# Altium schematic sheet AudioReactiveCircuit_schematic_V1.SchDoc
size A; SheetNumber: 1; SheetTotal: 1
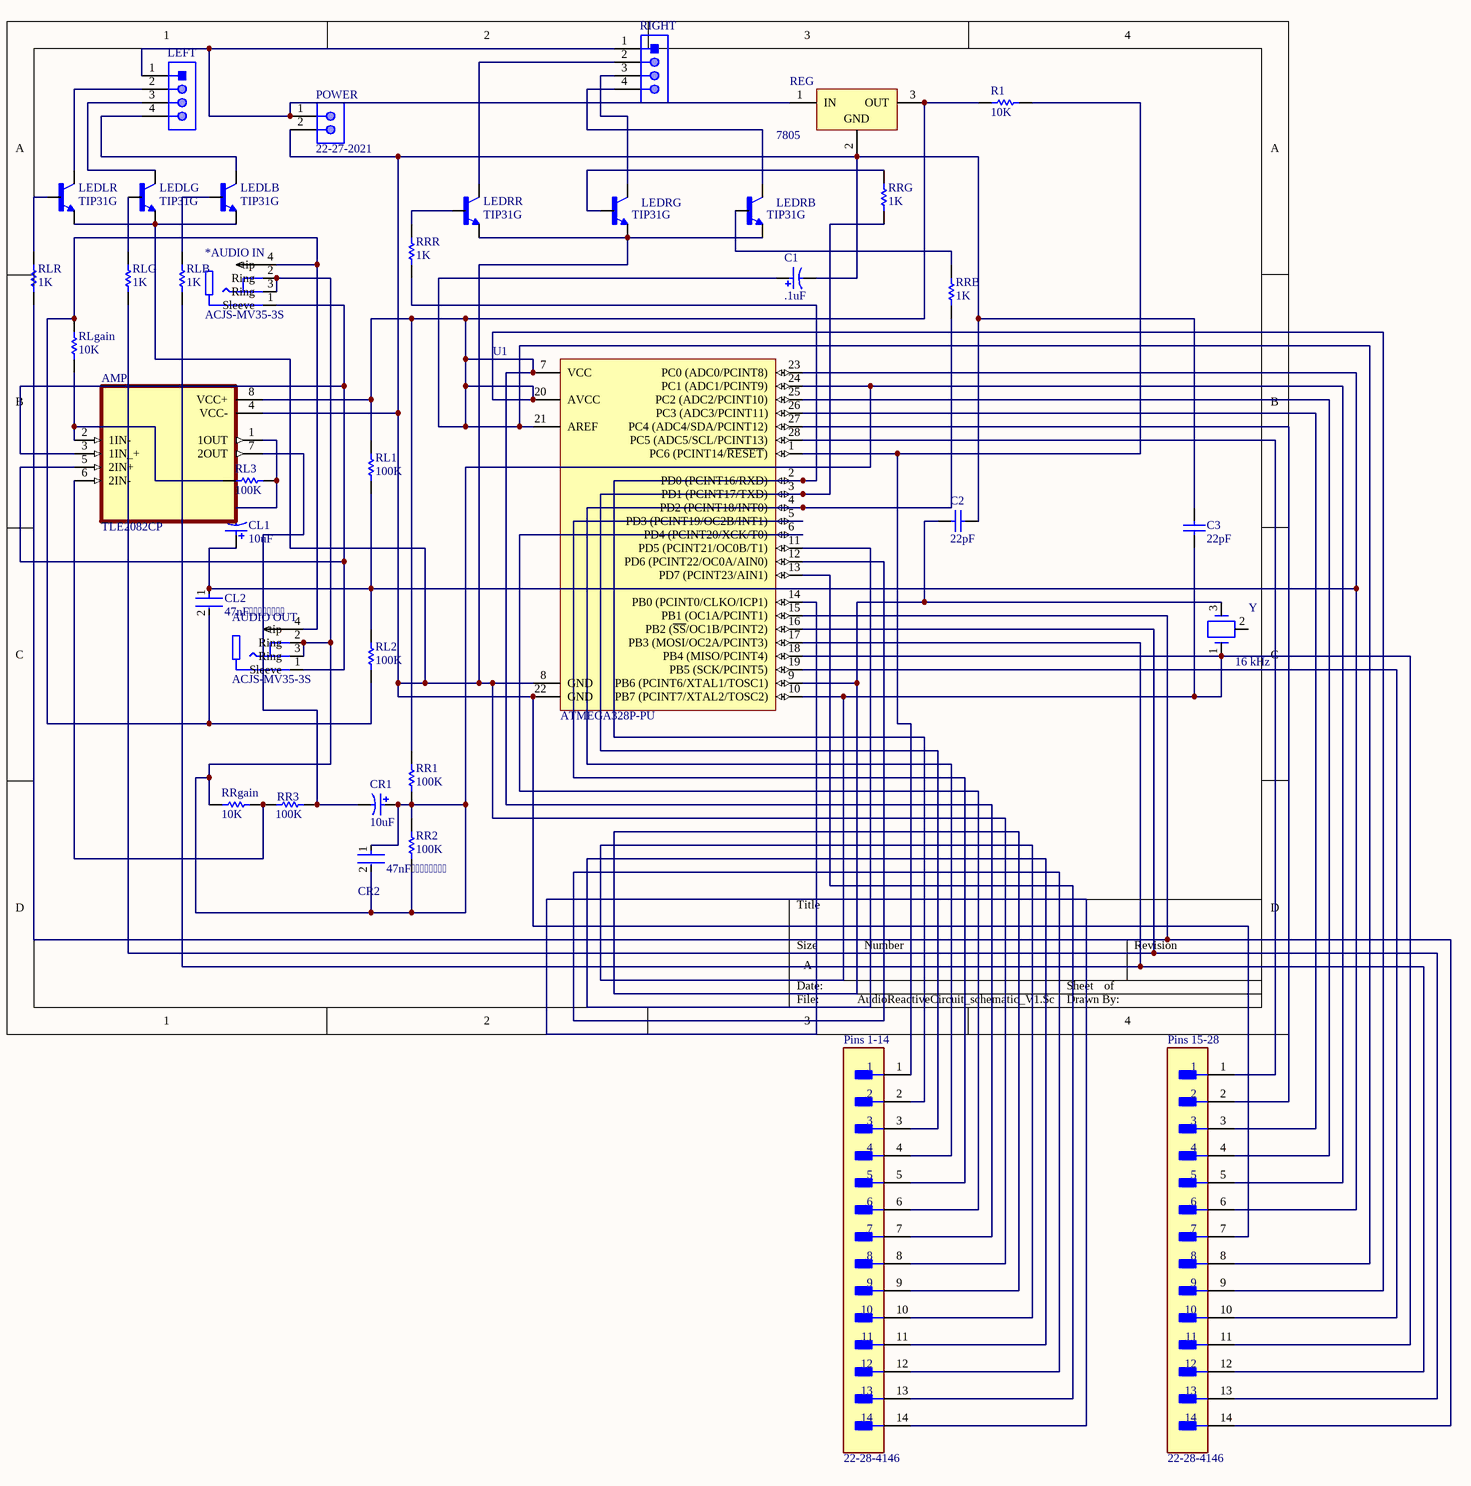
[diagram p0: AudioReactiveCircuit_schematic_V1.SchDoc]

## Parts
*AUDIO_IN  ACJS-MV35-3S  [AMPHENOL_ACJM-MV35-2S]
AMP  TLE2082CP  [DIP794W45P254L959H508Q8]
AUDIO_OUT  ACJS-MV35-3S  [AMPHENOL_ACJM-MV35-2S]
C1  .1uF  [CAPPR55-200-1100X500X1200]
C2  22pF  [KEMT-C315-THT-2]
C3  22pF  [KEMT-C315-THT-2]
CL1  10uF  [CAPPR55-200-1100X500X1200]
CL2  47nF  [FP-RDE2M1-MFG]
CR1  10uF  [CAPPR55-200-1100X500X1200]
CR2  47nF  [FP-RDE2M1-MFG]
LEDLB  TIP31G  [TO254P1060X482X2222-3]
LEDLG  TIP31G  [TO254P1060X482X2222-3]
LEDLR  TIP31G  [TO254P1060X482X2222-3]
LEDRB  TIP31G  [TO254P1060X482X2222-3]
LEDRG  TIP31G  [TO254P1060X482X2222-3]
LEDRR  TIP31G  [TO254P1060X482X2222-3]
LEFT  61300411121  [61300411121]  (value not drawn)
Pins_1-14  22-28-4146  [FP-22-28-4146-MFG]
Pins_15-28  22-28-4146  [FP-22-28-4146-MFG]
POWER  22-27-2021  [MOLX-22-27-2021_V]
R1  10K  [RESA60-630X240]
REG  7805  [TO220]
RIGHT  6  [61300411121]  (value not drawn)
RL1  100K  [RESA60-630X240]
RL2  100K  [RESA60-630X240]
RL3  100K  [RESA60-630X240]
RLB  1K  [RESA60-630X240]
RLG  1K  [RESA60-630X240]
RLgain  10K  [RESA60-630X240]
RLR  1K  [RESA60-630X240]
RR1  100K  [RESA60-630X240]
RR2  100K  [RESA60-630X240]
RR3  100K  [RESA60-630X240]
RRB  1K  [RESA60-630X240]
RRG  1K  [RESA60-630X240]
RRgain  10K  [RESA60-630X240]
RRR  1K  [RESA60-630X240]
U1  ATMEGA328P-PU  [ATML-28P3]
Y  16 kHz  [ECS-4X-3IL]

## Nets
Net*AUDIO_IN_1: *AUDIO_IN.1(Sleeve) AMP.3(1IN_+) AMP.5(2IN+) AUDIO_OUT.1(Sleeve)
Net*AUDIO_IN_2: *AUDIO_IN.2(Ring) *AUDIO_IN.3(Ring) AUDIO_OUT.2(Ring) AUDIO_OUT.3(Ring) CR1.1 CR2.1 CR2.2 Pins_15-28.5 RR1.1 RR2.1 RR2.2 RRgain.2 U1.24(PC1_(ADC1/PCINT9))
Net*AUDIO_IN_4: *AUDIO_IN.4(tip) AUDIO_OUT.4(tip) CL2.2 RL2.1 RLgain.2
NetAMP_1: AMP.1(1OUT) CL1.2 RL3.1
NetAMP_2: AMP.2(1IN-) RL3.2 RLgain.1
NetAMP_4: AMP.4(VCC-) C1.2 C2.1 C3.2 LEDLB.3(E) LEDLG.3(E) LEDLR.3(E) LEDRB.3(E) LEDRG.3(E) LEDRR.3(E) Pins_1-14.8 Pins_15-28.7 POWER.2 REG.2(GND) U1.8(GND) U1.22(GND)
NetAMP_6: AMP.6(2IN-) RR3.2 RRgain.1
NetAMP_7: AMP.7(2OUT) CR1.2 RR3.1
NetAMP_8: AMP.8(VCC+) C1.1 Pins_1-14.7 Pins_15-28.8 Pins_15-28.9 R1.1 REG.3(OUT) RL1.2 RR1.2 U1.7(VCC) U1.20(AVCC) U1.21(AREF)
NetC2_2: C2.2 Pins_1-14.9 U1.9(PB6_(PCINT6/XTAL1/TOSC1)) Y.3
NetC3_1: C3.1 Pins_1-14.10 Pins_15-28.11 U1.10(PB7_(PCINT7/XTAL2/TOSC2)) U1.18(PB4_(MISO/PCINT4)) Y.1
NetCL1_1: CL1.1 CL2.1 Pins_15-28.6 RL1.1 RL2.2 U1.23(PC0_(ADC0/PCINT8))
NetLEDLB_1: LEDLB.1(B) RLB.2
NetLEDLB_2: LEDLB.2(C) LEFT.4
NetLEDLG_1: LEDLG.1(B) RLG.1
NetLEDLG_2: LEDLG.2(C) LEFT.3
NetLEDLR_1: LEDLR.1(B) RLR.1
NetLEDLR_2: LEDLR.2(C) LEFT.2
NetLEDRB_1: LEDRB.1(B) RRB.2
NetLEDRB_2: LEDRB.2(C) RIGHT.4
NetLEDRG_1: LEDRG.1(B) RRG.2
NetLEDRG_2: LEDRG.2(C) RIGHT.3
NetLEDRR_1: LEDRR.1(B) RRR.2
NetLEDRR_2: LEDRR.2(C) RIGHT.2
NetLEFT_1: LEFT.1 POWER.1 REG.1(IN) RIGHT.1
NetPins_1-14_1: Pins_1-14.1 R1.2 U1.1(PC6_(PCINT14/~{RESET}))
NetPins_1-14_2: Pins_1-14.2 RRR.1 U1.2(PD0_(PCINT16/RXD))
NetPins_1-14_3: Pins_1-14.3 RRG.1 U1.3(PD1_(PCINT17/TXD))
NetPins_1-14_4: Pins_1-14.4 RRB.1 U1.4(PD2_(PCINT18/INT0))
NetPins_1-14_5: Pins_1-14.5 U1.5(PD3_(PCINT19/OC2B/INT1))
NetPins_1-14_6: Pins_1-14.6 U1.6(PD4_(PCINT20/XCK/T0))
NetPins_1-14_11: Pins_1-14.11 U1.11(PD5_(PCINT21/OC0B/T1))
NetPins_1-14_12: Pins_1-14.12 U1.12(PD6_(PCINT22/OC0A/AIN0))
NetPins_1-14_13: Pins_1-14.13 U1.13(PD7_(PCINT23/AIN1))
NetPins_1-14_14: Pins_1-14.14 U1.14(PB0_(PCINT0/CLKO/ICP1))
NetPins_15-28_1: Pins_15-28.1 U1.28(PC5_(ADC5/SCL/PCINT13))
NetPins_15-28_2: Pins_15-28.2 U1.27(PC4_(ADC4/SDA/PCINT12))
NetPins_15-28_3: Pins_15-28.3 U1.26(PC3_(ADC3/PCINT11))
NetPins_15-28_4: Pins_15-28.4 U1.25(PC2_(ADC2/PCINT10))
NetPins_15-28_10: Pins_15-28.10 U1.19(PB5_(SCK/PCINT5))
NetPins_15-28_12: Pins_15-28.12 RLB.1 U1.17(PB3_(MOSI/OC2A/PCINT3))
NetPins_15-28_13: Pins_15-28.13 RLG.2 U1.16(PB2_(~{SS}/OC1B/PCINT2))
NetPins_15-28_14: Pins_15-28.14 RLR.2 U1.15(PB1_(OC1A/PCINT1))

Not connected (* = marked no-connect by the designer): Y 2

## Library data of the parts
*AUDIO_IN AUDIO_OUT = CMP-00027-00002-1: Conn 3.5MM Audio Jack F 3 POS Solder ST Thru-Hole 4 Terminal 1 Port
C1 = CMP-1665-00038-2: Aluminum Electrolytic Capacitor, 10 uF, +/- 20%, 50 V, -40 to 85 degC, 2-Pin THD, RoHS, Bulk; Manufacturer: Panasonic; Life (Hours): 2000Hour; Lead/Base Style: Straight; Dissipation Factor: 0.12%; Capacitance: 10uF; Leakage Current: 3uA; Dielectric Material: Aluminium; Lead Diameter: 0.5mm; Voltage Rating: 50V; Ripple Current: 65mA; Package Reference: CAPPR55-200-1100X500X1200; Height: 11mm; Diameter: 5mm; REACH SVHC: NoSVHC; Mount: ThroughHole; Packaging: Bulk; Manufacturer URL: http://www.panasonic.com/; Termination: Radial; Datasheet URL: https://industrial.panasonic.com/cdbs/www-data/pdf/RDF0000/ABA0000C1218.pdf; Lead Free: LeadFree; Height - Seated (Max): 0.472inch; Case/Package: Radial; Package Description: 2-Pin Radial Lead, Dia 5 mm, Height 12 mm; Tolerance: 20%; Datasheet Version: Rev. 05, 10/2016; Package Quantity: 200; Ripple Current (AC): 65mA; Min Operating Temperature: -40degC; RoHSCompliant: true; Number of Pins: 2; Max Operating Temperature: 85degC; Voltage: 50V; Lead Pitch: 2mm; Radiation Hardening: No; Voltage Rating (DC): 50V; Length: 11mm
C2 C3 = CMP-1664-00008-1: Capacitor, Ceramic, 22 pF, +/-10 %, 100 V, -55 to 125 degC, 2-Pin THD, RoHS, Bulk; Max Input Voltage: 40 V; Min Input Voltage: 4.2 V; Output Current: 1.5 A; Output Voltage: 1.2 V; Outputs: 1; Case\Package: TO-220; RoHSCompliant: true; Min Operating Temperature: 0 degC; Max Operating Temperature: 125 degC; Package Quantity: 50; ComponentLink2URL: http://capacitoredge.kemet.com/capedge2/DataSheet/Datasheet-C315C220K1G5TA.pdf?pn=C315C220K1G5TA{BULK}; Radiation Hardening: No; Pins: 3; Length: 10.28 mm; ComponentLink1URL: http://www.kemet.com/; ComponentLink2Description: Datasheet; Height: 9.28 mm; REACH SVHC: No SVHC; ComponentLink1Description: Manufacturer URL; Max Ouput Current: 1.5 A; Weight: 0.08113 oz; Packaging: Rail/Tube; DatasheetVersion: Aug-16; Mount: Through Hole; PackageReference: C315-THT-2; Width: 4.82 mm; PackageDescription: 2-Pin Through Hole Device, Body 3.81 x 2.54 mm
CL1 CR1 = CMP-1665-00038-2: Aluminum Electrolytic Capacitor, 10 uF, +/- 20%, 50 V, -40 to 85 degC, 2-Pin THD, RoHS, Bulk; Manufacturer: Panasonic; Life (Hours): 2000Hour; Lead/Base Style: Straight; Dissipation Factor: 0.12%; Leakage Current: 3uA; Dielectric Material: Aluminium; Lead Diameter: 0.5mm; Voltage Rating: 50V; Ripple Current: 65mA; Package Reference: CAPPR55-200-1100X500X1200; Height: 11mm; Diameter: 5mm; REACH SVHC: NoSVHC; Mount: ThroughHole; Packaging: Bulk; Manufacturer URL: http://www.panasonic.com/; Capacitance: 10uF; Termination: Radial; Datasheet URL: https://industrial.panasonic.com/cdbs/www-data/pdf/RDF0000/ABA0000C1218.pdf; Lead Free: LeadFree; Height - Seated (Max): 0.472inch; Case/Package: Radial; Package Description: 2-Pin Radial Lead, Dia 5 mm, Height 12 mm; Tolerance: 20%; Datasheet Version: Rev. 05, 10/2016; Package Quantity: 200; Ripple Current (AC): 65mA; Min Operating Temperature: -40degC; RoHSCompliant: true; Number of Pins: 2; Max Operating Temperature: 85degC; Voltage: 50V; Lead Pitch: 2mm; Radiation Hardening: No; Voltage Rating (DC): 50V; Length: 11mm
CL2 CR2 = CMP-06035-044503-1: Ceramic Capacitor 47nF ±10% 450V X7T Radial; Max Operating Temperature: 125°C; Voltage Rating: 450V; Capacitance: 47nF; Lead Pitch: 5mm; Dielectric: X7T; Case/Package: Radial; Min Operating Temperature: -55°C; Tolerance: 10%; REACH SVHC: No SVHC; Voltage Rating (DC): 450V
LEDLB LEDLG LEDLR LEDRB LEDRG LEDRR = TIP31G: Bipolar (BJT) Transistor NPN 40 V 3 A 3MHz 2 W Through Hole TO-220; MF: ON Semiconductor; SnapEDA_Link: https://www.snapeda.com/parts/TIP31G/Onsemi/view-part/?ref=snap; Availability: In Stock; Purchase-URL: https://pricing.snapeda.com/search/part/TIP31G/?ref=eda; Check_prices: https://www.snapeda.com/parts/TIP31G/Onsemi/view-part/?ref=eda; Value: *; Package: TO-220-3 ON Semiconductor; MP: TIP31G; Price: None
LEFT RIGHT = CMP-1502-01064-1: THT Vertical Pin Header WR-PHD, Pitch 2.54 mm, Single Row, 4 pins; Manufacturer: Wurth Elektronik; Withstanding Voltage: 500VAC; Rated Current: 3A; Working Voltage: 250VAC; Pin Number: 4; Gender: Male; Contact Resistance: 20mOhm; Pitch: 2.54mm; Manufacturer URL: http://www.we-online.de; Operating Temperature: -40to105degC; Packaging: Bag; Mounting Technology: THT; Package Reference: 61300411121; Datasheet URL: https://katalog.we-online.de/em/datasheet/6130xx11121.pdf; Publisher: WurthElektronik; Part Number: 61300411121; Row Number: Single; Orientation: Vertical
Pins_1-14 Pins_15-28 = CMP-04776-000356-1: CONN HEADER VERT 14POS 2.54MM; Number of Contacts: 14; Voltage Rating: 250V; Glow Wire Compliant: Non-compliant; Connector Type: Male Pin; Pitch: 0.1inch; Current Rating: 4A; Gender: Male; RoHS Compliant: Yes; Packaging: Bulk; Housing Material: Thermoplastic; Package Quantity: 1; Number of Positions: 14; Color: Black; Length: 35.6mm; Width: 2.49mm; Termination: Solder; Contact Mating Length: 0.24inch; Series: KK® 42375; Mount: Through Hole; Contact Gender: Male; Number of Circuits: 14; Orientation: Vertical; Contact Type: Male Pin; Contact Plating: Gold; Lead Free: Lead Free; Number of Rows: 1; Height: 2.29mm; Contact Material: Brass; Housing Color: Black
POWER = CMP-2000-05537-1: Male Header, Pitch 2.54 mm, 1 x 2 Position, Height 11.7 mm, Tail Length 3.56 mm, 0 to 75 degC, RoHS, Bulk; Manufacturer: Molex; PartNumber: 0022272021; Current rating: 4A; Package Version: Rev. BC, 02/2012; Voltage rating: 250V; No. of Positions: 2; Pitch: 2.54mm; No. of Rows: 1; Orientation: Vertical; Operating temperature: 0°Cto+75°C; Manufacturer URL: http://www.molex.com/; Mounting Technology: ThroughHole; Housing material: Nylon(UL94V-0); Package Description: 2-Leads Header, Body 5.08 x 5.8 mm, Pitch 2.54 mm; Voltage - Max: 250V; Datasheet URL: http://www.molex.com/pdm_docs/sd/022272021_sd.pdf; Package Reference: 22-27-2021; Contact material: Tinplatedbrass; Current - Max: 4A; Datasheet Version: Rev. F, 06/2009
R1 RL1-RL3 RLB RLG RLgain RLR RR1-RR3 RRB RRG RRgain RRR = CMP-1659-00073-1: Axial Resistor, 100 KOhm, +/- 1%, 0.25 W, -55 to 155 degC, 2-Pin THD, RoHS, Bulk; Voltage Rating: 250 V; Power Rating: 250 mW; Resistance: 475 Ohm; PackageDescription: 2-Pin Axial Lead, Dia 2.4 mm, Body Length 6.3 mm; PackageReference: MFR-25; Length: 0.248 inch; ComponentLink2Description: Datasheet; Packaging: Bulk; DatasheetVersion: Apr-13; Package Quantity: 200; Min Operating Temperature: -55 degC; ComponentLink2URL: http://www.yageo.com/documents/recent/Yageo%20LR_MFR_2013.pdf; RoHSCompliant: true; ComponentLink1URL: http://www.yageo.com/; Tolerance: 1%; Case\Package: Axial; Mount: Through Hole; ComponentLink1Description: Manufacturer URL; Max Operating Temperature: 155 degC
REG = CMP-0244-00483-1: Positive Voltage Regulator, 5V, 3-Pin TO-220; PackageDescription: TO, Thru-Hole, Vertical, Heatsink Mounted; 3 In-Line Leads; Pitch 2.54 mm; ComponentLink2Description: Datasheet; PackageReference: TO220; ComponentLink3URL: http://www.st.com/internet/com/TECHNICAL_RESOURCES/TECHNICAL_LITERATURE/PACKAGE_INFORMATION/CD00004649.pdf; DatasheetVersion: 16/11/2011; ComponentLink1Description: Manufacturer URL; ComponentLink1URL: http://www.st.com; PackageVersion: ver3.0; ComponentLink3Description: Package Specification; ComponentLink2URL: http://www.st.com/internet/com/TECHNICAL_RESOURCES/TECHNICAL_LITERATURE/DATASHEET/CD00000444.pdf
U1 = CMP-020-00004-3: 8-Bit Microcontroller with 32 KBytes In-System Programmable Flash, 23 I/Os, -40 to 85 degC, 28-Pin PDIP (28P3), RoHS, Tube; Manufacturer: Atmel; I/Os: 23; Density: 32KB; Package Version: Rev. B, 09/2001; Max Clock Frequency: 20MHz; Interface: USART; Max Supply Voltage: 5.5V; Min Supply Voltage: 1.8V; Ethernet Channels: 0; RAM Size: 2KB; RoHS Compliant: True; Datasheet URL: http://www.atmel.com/images/Atmel-8271-8-bit-AVR-Microcontroller-ATmega48A-48PA-88A-88PA-168A-168PA-328-328P_datasheet_Complete.pdf; Packaging: Rail/Tube; Manufacturer URL: http://www.atmel.com/; Mounting Technology: TH; Package URL: http://www.atmel.com/images/Atmel-8271-8-bit-AVR-Microcontroller-ATmega48A-48PA-88A-88PA-168A-168PA-328-328P_datasheet_Complete.pdf; Datasheet Version: Rev. 8271J, 11/2015; Package Description: 28-Pin Plastic Dual Inline Package, Body 34.671 x 7.3025 mm, Pitch 2.54 mm; Package Quantity: 14; Min Operating Temperature: -40°C; Max Operating Temperature: 85°C; Case/Package: DIP; Pins: 28; Package Reference: 28P3
Y = CMP-1669-00002-2: CRYSTAL 8.00 MHZ 20PF 49US; PartNumber: ECS-80-20-4X; Manufacturer: ECS; ComponentLink1URL: http://www.ecsxtal.com/store/pdf/hc-49usx.pdf; ComponentLink1Description: Datasheet; PackageReference: 4X-3IL
AMP = TLE2082CP: Package: None; Price: None; Value: *; MP: TLE2082CP; Availability: Unavailable